# Altium project Temp_recorder_SAMD21.PrjPcb (part 2 of 2)

## Sheet RTD_Channel.SchDoc: RTD
size 420 x 297 mm; Author: G.Kasprowicz; CompanyName: WUT ISE; DrawnBy: G.Kasprowicz; Organization: WUT ISE; Address1: PW ISE; Address2: Nowowiejska 15/19 00-665 Warsaw; Address3: gkasprow@gmail.com; DocumentNumber: 2; Revision: 1.0; SheetNumber: 2; SheetTotal: 5; ModifiedBy: -; CheckedDate: -; Title2: converter; DivGrp: WUT ISE; Designer: G.Kasprowicz; ModifiedDate: -; ProjectName: Sensor Box
Used 8 times, as channels U_RTD_Channel0, U_RTD_Channel1, U_RTD_Channel2, U_RTD_Channel3, U_RTD_Channel4, U_RTD_Channel5, U_RTD_Channel6, U_RTD_Channel7. Parts and nets are listed once, with the designators drawn on the sheet.
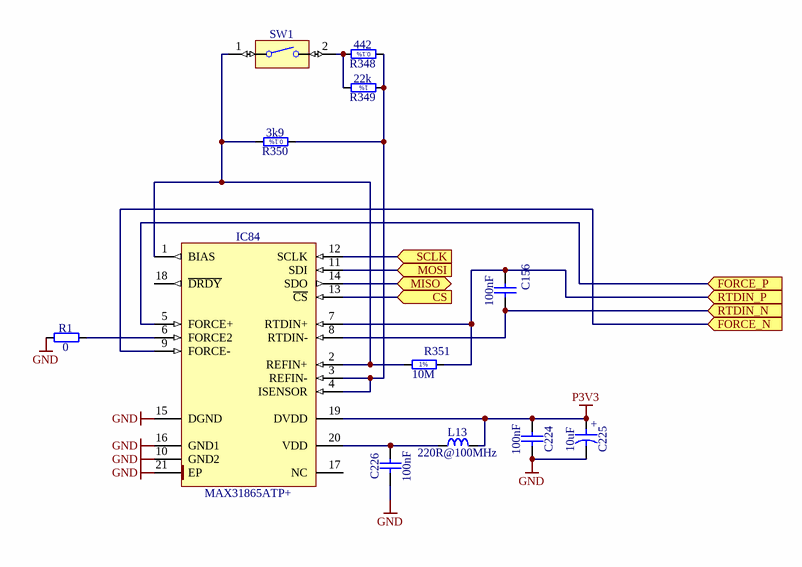
[diagram p2: RTD_Channel.SchDoc]

### Parts
C156  100nF  [CAPC1005X55N]
C224  100nF  [CAPC1005X55N]
C225  10uF  [CAPMP3216X180N]
C226  100nF  [CAPC1005X55N]
IC84  MAX31865ATP+  [QFN65P500X500X80-21N-S335]
L13  220R@100MHz  [INDC1005X55N]
R1  0  [RESC1005X40N]
R348  442  [RESC1608X55N]
R349  22k  [RESC1005X40N]
R350  3k9  [RESC1608X55N]
R351  10M  [RESC1608X55N]
SW1  Switch  [SW_OMRON_A6SN-1101]  (value not drawn)

### Ports
CS (in), FORCE_N (in), FORCE_P (in), MISO (bidir), MOSI (in), RTDIN_N (in), RTDIN_P (in), SCLK (in)

### Nets
GND: C224.2 C225.2 C226.1 IC84.10(GND2) IC84.15(DGND) IC84.16(GND1) IC84.21(EP) R1.1
P3V3: C224.1 C225.1 IC84.19(DVDD) L13.2
CS: IC84.13(~{CS}) ; port CS
FORCE_N: IC84.9(FORCE-) ; port FORCE_N
FORCE_P: IC84.5(FORCE+) ; port FORCE_P
MISO: IC84.14(SDO) ; port MISO
MOSI: IC84.11(SDI) ; port MOSI
RTDIN_N: C156.2 IC84.8(RTDIN-) ; port RTDIN_N
RTDIN_P: C156.1 IC84.7(RTDIN+) R351.2 ; port RTDIN_P
SCLK: IC84.12(SCLK) ; port SCLK
NetC226_2: C226.2 IC84.20(VDD) L13.1
NetIC84_1: IC84.1(BIAS) IC84.2(REFIN+) R350.2 R351.1 SW1.1
NetIC84_3: IC84.3(REFIN-) IC84.4(ISENSOR) R348.1 R349.1 R350.1
NetIC84_6: IC84.6(FORCE2) R1.2
NetR348_2: R348.2 R349.2 SW1.2

Not connected (* = marked no-connect by the designer): IC84 17(NC) 18(~{DRDY})

### Channels
U_RTD_Channel0: designators end in A; ports CS=MAX_CS0 FORCE_N=FORCE_N0 FORCE_P=FORCE_P0 MISO=MAX_MISO MOSI=MAX_MOSI RTDIN_N=RTDIN_N0 RTDIN_P=RTDIN_P0 SCLK=MAX_SCLK
U_RTD_Channel1: designators end in B; ports CS=MAX_CS1 FORCE_N=FORCE_N1 FORCE_P=FORCE_P1 MISO=MAX_MISO MOSI=MAX_MOSI RTDIN_N=RTDIN_N1 RTDIN_P=RTDIN_P1 SCLK=MAX_SCLK
U_RTD_Channel2: designators end in C; ports CS=MAX_CS2 FORCE_N=FORCE_N2 FORCE_P=FORCE_P2 MISO=MAX_MISO MOSI=MAX_MOSI RTDIN_N=RTDIN_N2 RTDIN_P=RTDIN_P2 SCLK=MAX_SCLK
U_RTD_Channel3: designators end in D; ports CS=MAX_CS3 FORCE_N=FORCE_N3 FORCE_P=FORCE_P3 MISO=MAX_MISO MOSI=MAX_MOSI RTDIN_N=RTDIN_N3 RTDIN_P=RTDIN_P3 SCLK=MAX_SCLK
U_RTD_Channel4: designators end in E; ports CS=MAX_CS4 FORCE_N=FORCE_N4 FORCE_P=FORCE_P4 MISO=MAX_MISO MOSI=MAX_MOSI RTDIN_N=RTDIN_N4 RTDIN_P=RTDIN_P4 SCLK=MAX_SCLK
U_RTD_Channel5: designators end in F; ports CS=MAX_CS5 FORCE_N=FORCE_N5 FORCE_P=FORCE_P5 MISO=MAX_MISO MOSI=MAX_MOSI RTDIN_N=RTDIN_N5 RTDIN_P=RTDIN_P5 SCLK=MAX_SCLK
U_RTD_Channel6: designators end in G; ports CS=MAX_CS6 FORCE_N=FORCE_N6 FORCE_P=FORCE_P6 MISO=MAX_MISO MOSI=MAX_MOSI RTDIN_N=RTDIN_N6 RTDIN_P=RTDIN_P6 SCLK=MAX_SCLK
U_RTD_Channel7: designators end in H; ports CS=MAX_CS7 FORCE_N=FORCE_N7 FORCE_P=FORCE_P7 MISO=MAX_MISO MOSI=MAX_MOSI RTDIN_N=RTDIN_N7 RTDIN_P=RTDIN_P7 SCLK=MAX_SCLK

### Notes on the sheet
- Project/Equipment
- Document
- Designer
- Drawn by
- Check.by
- Copyright WUT ISE 2020.
  This documentation describes Open Hardware and is licensed under the CERN OHL v.1.2. You may redistribute and modify this documentation under the terms of the CERN OHL v.1.2. (http://ohwr.org/CERNOHL). This documentation is distributed WITHOUT ANY EXPRESS OR IMPLIED WARRANTY, INCLUDING OF MERCHANTABILITY, SATISFACTORY QUALITY AND FITNESS FOR A PARTICULAR PURPOSE. Please see the CERN OHL v.1.2 for applicable conditions.
- Contact
- File
- Last Mod.
- Print Date
- Sheet
- Size
- A3
- of
- Rev
- (in symbol CTE3216-18_10UF_16V_20%_AVX_TCJ) +
- (in symbol R0402_22K_1%_0.0625W_100PPM) 1%
- (in symbol R0603_10M_1%_0.1W_100PPM) 1%
- (in symbol RES_0603_3k9_0.1%_10ppm) 0.1%
- (in symbol RES_0603_442R_0.1%_25ppm) 0.1%

### Library data of the parts
C156 C224 C226 = CC0402_100NF_16V_10%_X5R: Non-polarised capacitor; Part Description: SMD Multilayer Chip Ceramic Capacitor; Manufacturer: GENERIC; Manufacturer1 Part Number: GRM155R61C104KA88D; Voltage: 16V; TC: X5R; Tolerance: ±10%; Part Number: CC0402_100NF_16V_10%_X5R; Component Kind: Standard; Component Type: Standard; Pin Count: 2; Value: 100nF; Status: None; Manufacturer Part Number: CC0402_100NF_16V_10%_X5R; Case: 0402; Mounted: Yes; Socket: No; SMD: Yes; Sense: No; Manufacturer1 Example: MURATA; Manufacturer1 ComponentHeight: 0.55mm; HelpURL: \\cern.ch\dfs\Applications\Altium\Datasheets\CC0402_X5R_MURATA_GRM.pdf; Author: CERN DEM JLC; CreateDate: 10.12.2013; LatestRevisionDate: 10.12.2013
C225 = CTE3216-18_10UF_16V_20%_AVX_TCJ: Polarised capacitor; Part Description: ESR 0R200 Tantalum Solid Electrolytic Chip Capacitor with Conductive Polymer Electrode; Manufacturer: AVX; Manufacturer Part Number: TCJA106M016R0200; Voltage: 16V; Tolerance: ±20%; Part Number: CTE3216-18_10UF_16V_20%_AVX_TCJ; Component Kind: Standard; Component Type: Standard; Pin Count: 2; Value: 10uF; Status: Preferred; Case: A; Mounted: Yes; Socket: No; SMD: Yes; Sense: No; ComponentHeight: 1.8mm; HelpURL: \\cern.ch\dfs\Applications\Altium\Datasheets\CTE_AVX_TCJ.pdf; Author: CERN DEM JLC; CreateDate: 29.03.2012; LatestRevisionDate: 29.03.2012
IC84 = MAX31865ATP+: RTD-to-Digital Converter; Manufacturer: MAXIM; PressFit: No; Bonding: No; Part Number: MAX31865ATP+; Component Kind: Standard; Component Type: Standard; Device: MAX31865ATP+; PackageDescription: QFN, 0.65mm pitch, Square; 20 pin, 5.00mm L X 5.00mm W X 0.80mm H Body (W/Thermal Tab 3.35mm X 3.35mm), IPC Medium Density; Part Description: RTD-to-Digital Converter; Manufacturer Part Number: MAX31865ATP+; Pin Count: 21; Case: QFN20; Mounted: Yes; Socket: No; SMD: Yes; Sense: No; ComponentHeight: 0.8mm; Author: CERN DEM MR; HelpURL: \\cern.ch\dfs\Applications\Altium\Datasheets\MAX31865ATP+.pdf; CreateDate: 09.06.2016; LatestRevisionDate: 09.06.2016
L13 = IND0402_MURATA_BLM15HB221SN1: Inductor; Part Description: SMD EMIFIL Suppression Chip Ferrite Bead; Manufacturer: MURATA; Power: 250mA; Resistance: 1R; Tolerance: ±25%; Part Number: IND0402_MURATA_BLM15HB221SN1; Component Kind: Standard; Component Type: Standard; Pin Count: 2; Value: 220R@100MHz; Status: None; Manufacturer Part Number: BLM15HB221SN1; Case: 0402; Mounted: Yes; Socket: No; SMD: Yes; Sense: No; ComponentHeight: 0.55mm; HelpURL: \\cern.ch\dfs\Applications\Altium\Datasheets\IND0402_MURATA_BLM15H.pdf; Author: CERN DEM JLC; CreateDate: 23.06.2009; LatestRevisionDate: 23.06.2009
R1 = R0402_0R_JUMPER: Resistor; Part Description: 1A (0.05R Max DC Resistance) Zero Ohm Jumper; Manufacturer: GENERIC; Manufacturer1 Part Number: 232270591001L; PressFit: No; Part Number: R0402_0R_JUMPER; Component Kind: Standard; Component Type: Standard; Pin Count: 2; Value: 0; Status: Not Recommended; Manufacturer Part Number: R0402_0R_JUMPER; Case: 0402; Mounted: Yes; Sense: No; Socket: No; SMD: Yes; Manufacturer1 Example: YAGEO PHYCOMP; Manufacturer1 ComponentHeight: 0.4mm; HelpURL: \\cern.ch\dfs\Applications\Altium\Datasheets\R0402_Phycomp_RC0402.pdf; Author: CERN DEM JLC; CreateDate: 03/12/2007; LatestRevisionDate: 17/10/2012
R348 = RES_0603_442R_0.1%_25ppm: Resistor - 0.1%; Part Number: R0603_442R_0.1%_0.063W_25PPM; Part Description: Thin Film Chip Resistor; Manufacturer: GENERIC; Manufacturer1 Part Number: RP73PF1J442RBTDF; Power: 0.063W; TC: ±25ppm; PressFit: No; Component Kind: Standard; Component Type: Standard; Pin Count: 2; Value: 442; Status: Not Recommended; Tolerance: ±0.1%; Manufacturer Part Number: R0603_442R_0.1%_0.063W_25PPM; Case: 0603; Mounted: Yes; Sense: No; Socket: No; SMD: Yes; Manufacturer1 Example: TYCO HOLSWORTHY; Manufacturer1 ComponentHeight: 0.5mm; HelpURL: \\cern.ch\dfs\Applications\Altium\Datasheets\R0603_Tyco_RN73.pdf; Author: GK; CreateDate: 03.12.2007; LatestRevisionDate: 13.03.2008
R349 = R0402_22K_1%_0.0625W_100PPM: Resistor - 1%; Part Description: General Purpose Thick Film Chip Resistor; Manufacturer: GENERIC; Manufacturer1 Part Number: 232270672203L; TC: ±100ppm/°C; PressFit: No; Part Number: R0402_22K_1%_0.0625W_100PPM; Component Kind: Standard; Component Type: Standard; Pin Count: 2; Value: 22k; Status: Not Recommended; Power: 0.0625W; Tolerance: ±1%; Manufacturer Part Number: R0402_22K_1%_0.0625W_100PPM; Case: 0402; Mounted: Yes; Sense: No; Socket: No; SMD: Yes; Manufacturer1 Example: YAGEO PHYCOMP; Manufacturer1 ComponentHeight: 0.4mm; HelpURL: \\cern.ch\dfs\Applications\Altium\Datasheets\R0402_Phycomp_RC0402.pdf; Author: CERN DEM JLC; CreateDate: 03.12.2007; LatestRevisionDate: 17.10.2012
R350 = RES_0603_3k9_0.1%_10ppm: Resistor - 0.1%; Part Number: R0603_3k9_0.1%_0.063W_10PPM; Part Description: Thin Film Chip Resistor; Manufacturer: GENERIC; Manufacturer1 Part Number: ERA3ARB392V; Power: 0.063W; TC: ±10ppm; PressFit: No; Component Kind: Standard; Component Type: Standard; Pin Count: 2; Value: 3k9; Status: Not Recommended; Tolerance: ±0.1%; Manufacturer Part Number: R0603_3k9_0.1%_0.063W_10PPM; Case: 0603; Mounted: Yes; Sense: No; Socket: No; SMD: Yes; Manufacturer1 Example: Panasonic; Manufacturer1 ComponentHeight: 0.5mm; HelpURL: \\cern.ch\dfs\Applications\Altium\Datasheets\R0603_Tyco_RN73.pdf; Author: GK; CreateDate: 03.12.2007; LatestRevisionDate: 13.03.2008
R351 = R0603_10M_1%_0.1W_100PPM: Resistor - 1%; Part Description: General Purpose Thick Film Chip Resistor; Manufacturer: GENERIC; Manufacturer1 Part Number: CRCW060310M0FKEA; Power: 0.1W; TC: ±100ppm/°C; PressFit: No; Part Number: R0603_10M_1%_0.1W_100PPM; Component Kind: Standard; Component Type: Standard; Pin Count: 2; Value: 10M; Status: Preferred; Tolerance: ±1%; Manufacturer Part Number: R0603_10M_1%_0.1W_100PPM; Case: 0603; Mounted: Yes; Sense: No; Socket: No; SMD: Yes; Manufacturer1 Example: VISHAY; Manufacturer1 ComponentHeight: 0.55mm; HelpURL: \\cern.ch\dfs\Applications\Altium\Datasheets\R0603_VISHAY_CRCW e3.pdf; Author: CERN DEM JLC; CreateDate: 12.01.2017; LatestRevisionDate: 12.01.2017
SW1 = SW_OMRON_A6SN-1101: 1 Ways SPST DIP Switch; Part Description: 1 Way SPST Surface-Mounting Slide Switch With Flat Actuator, Contact Rating 25mA 24VDC; Manufacturer: OMRON; PressFit: No; Part Number: SW_OMRON_A6SN-1101; Component Kind: Standard; Component Type: Standard; Pin Count: 2; PackageDescription: Body 4.48x7.5mm, 1 Way SPST Surface-Mounting Slide Switch With Flat Actuator (A6SN Series); Family: Switch; Mounted: Yes; Socket: No; SMD: Yes; Sense: No; Status: None; Manufacturer Part Number: A6SN-1101; ComponentHeight: 4.6mm; HelpURL: \\cern.ch\dfs\Applications\Altium\Datasheets\SW_OMRON_A6SN-1101.pdf; Author: CERN DEM JLC; CreateDate: 25.02.2013; LatestRevisionDate: 25.02.2013

## Sheet Supply.SchDoc: Supply & POE
size 420 x 297 mm; Author: G.Kasprowicz; CompanyName: WUT ISE; DrawnBy: G.Kasprowicz; Organization: WUT ISE; Address1: PW ISE; Address2: Nowowiejska 15/19 00-665 Warsaw; Address3: gkasprow@gmail.com; DocumentNumber: 4; Revision: 2; SheetNumber: 4; SheetTotal: 5; ModifiedBy: -; CheckedDate: -; DivGrp: WUT ISE; Designer: G.Kasprowicz; ModifiedDate: -; ProjectName: Sensor Box
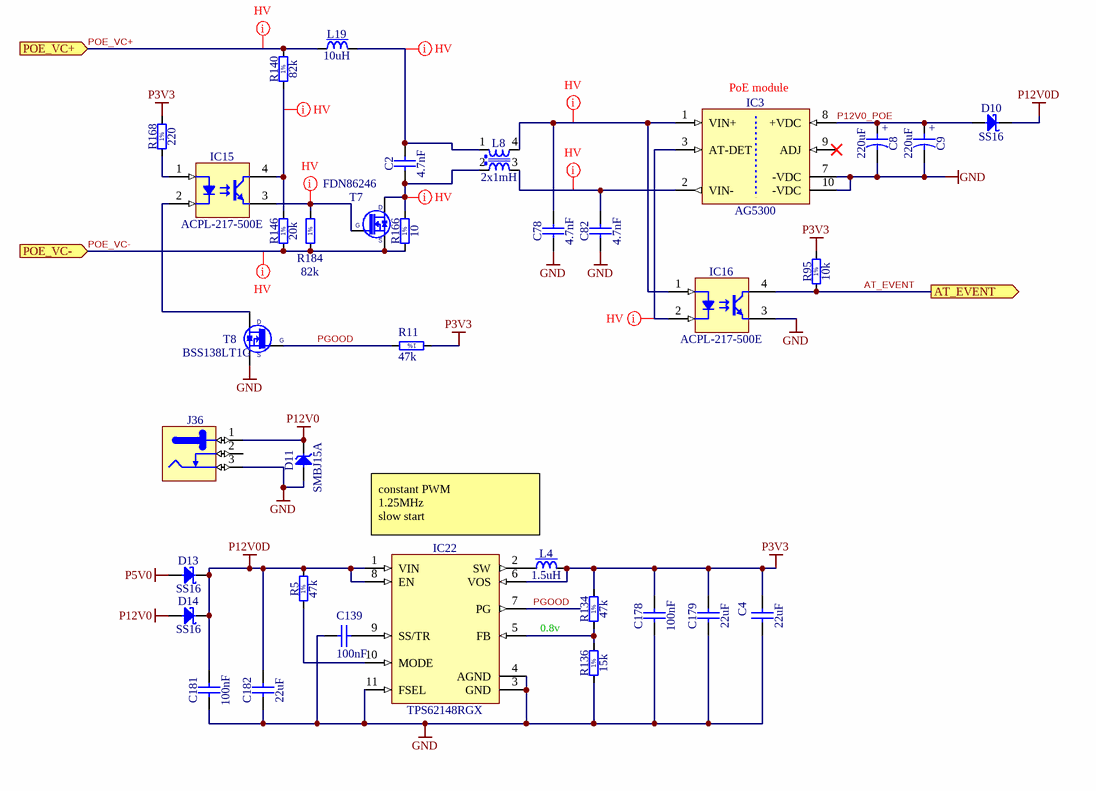
[diagram p3: Supply.SchDoc]

### Parts
C2  4.7nF  [CAPC3216X140N]
C4  22uF  [CAPC2012X135N]
C8  220uF  [CAPMP7343X430N]
C9  220uF  [CAPMP7343X430N]
C78  4.7nF  [CAPC3216X140N]
C82  4.7nF  [CAPC3216X140N]
C139  100nF  [CAPC1005X55N]
C178  100nF  [CAPC1005X55N]
C179  22uF  [CAPC2012X135N]
C181  100nF  [CAPC1005X55N]
C182  22uF  [CAPC2012X135N]
D10  SS16  [DIOM5127X229N]
D11  SMBJ15A  [DIOM5336X265N]
D13  SS16  [DIOM5127X229N]
D14  SS16  [DIOM5127X229N]
IC3  AG5300  [SILVERTEL_AG5300]
IC15  ACPL-217-500E  [SOIC127P700X242-4N]
IC16  ACPL-217-500E  [SOIC127P700X242-4N]
IC22  TPS62148RGX  [TEXAS_RGX0011A]
J36  Jack  [CLIFF_FC68148(DC-10A)]  (value not drawn)
L4  1.5uH  [IND_TDK_SPM6530]
L8  2x1mH  [IND_WURTH_WE-SL2]
L19  10uH  [IND_MURATA-PS_8400]
R5  47k  [RESC1608X55N]
R11  47k  [RESC1608X55N]
R95  10k  [RESC1005X40N]
R134  47k  [RESC1608X55N]
R136  15k  [RESC1608X55N]
R140  82k  [RESC1608X55N]
R146  20k  [RESC1005X40N]
R166  10  [RESC2012X60N]
R168  220  [RESC1608X55N]
R184  82k  [RESC1608X55N]
T7  FDN86246  [SOT95P237X112-3N]
T8  BSS138LT1G  [SOT95P240X110-3N]

### Ports
AT_EVENT (out), POE_VC+ (in), POE_VC- (in)

### Nets
GND: C4.1 C8.2 C9.2 C78.1 C82.1 C139.2 C178.1 C179.1 C181.1 C182.1 D11.2(A) IC3.7(-VDC) IC3.10(-VDC) IC16.3(E) IC22.3(GND) IC22.4(AGND) IC22.11(FSEL) J36.3 R136.1 T8.2(S)
P3V3: C4.2 C178.2 C179.2 IC22.6(VOS) L4.2 R11.1 R95.2 R134.2 R168.2
P5V0: D13.2(A)
P12V0: D11.1(C) D14.2(A) J36.1
P12V0D: C181.2 C182.2 D10.1(C) D13.1(C) D14.1(C) IC22.1(VIN) IC22.8(EN) R5.2
AT_EVENT: IC16.4(C) R95.1 ; port AT_EVENT
P12V0_POE: C8.1 C9.1 D10.2(A) IC3.8(+VDC)
PGOOD: IC22.7(PG) R11.2 T8.1(G)
POE_VC+: L19.1 R140.2 ; port POE_VC+
POE_VC-: R146.1 R166.1 R184.1 T7.2(S) ; port POE_VC-
NetC2_1: C2.1 L8.2 R166.2 T7.3(D)
NetC2_2: C2.2 L8.1 L19.2
NetC78_2: C78.2 IC3.1(VIN+) IC16.1(A) L8.4
NetC82_2: C82.2 IC3.2(VIN-) L8.3
NetC139_1: C139.1 IC22.9(SS/TR)
NetIC3_3: IC3.3(AT-DET) IC16.2(C)
NetIC15_1: IC15.1(A) R168.1
NetIC15_2: IC15.2(C) T8.3(D)
NetIC15_3: IC15.3(E) R184.2 T7.1(G)
NetIC15_4: IC15.4(C) R140.1 R146.2
NetIC22_2: IC22.2(SW) L4.1
NetIC22_5: IC22.5(FB) R134.1 R136.2
NetIC22_10: IC22.10(MODE) R5.1

Not connected (* = marked no-connect by the designer): IC3 9(ADJ)*; J36 2

### Layout directives
net class HV: NetC2_1, NetC2_2, NetC78_2, NetC82_2, NetIC3_3, NetIC15_3, NetIC15_4, POE_VC+, POE_VC-

### Notes on the sheet
- (near IC3) PoE module
- constant PWM
  1.25MHz
  slow start
- 0.8v
- Project/Equipment
- Document
- Designer
- Drawn by
- Check.by
- Copyright WUT ISE 2020.
  This documentation describes Open Hardware and is licensed under the CERN OHL v.1.2. You may redistribute and modify this documentation under the terms of the CERN OHL v.1.2. (http://ohwr.org/CERNOHL). This documentation is distributed WITHOUT ANY EXPRESS OR IMPLIED WARRANTY, INCLUDING OF MERCHANTABILITY, SATISFACTORY QUALITY AND FITNESS FOR A PARTICULAR PURPOSE. Please see the CERN OHL v.1.2 for applicable conditions.
- Contact
- File
- Last Mod.
- Print Date
- Sheet
- Size
- A3
- of
- Rev
- (in symbol CTE7343-43_220UF_16V_10%) +
- (in symbol R0402_10K_1%_0.0625W_100PPM) 1%
- (in symbol R0402_20K_1%_0.0625W_100PPM) 1%
- (in symbol R0603_15k_1%_0.1W_100PPM) 1%
- (in symbol R0603_47K_1%_0.1W_100PPM) 1%
- (in symbol R0603_82K_1%_0.1W_100PPM) 1%
- (in symbol R0603_220R_1%_0.1W_100PPM) 1%
- (in symbol R0805_10R_1%_0.125W_200PPM) 1%

### Library data of the parts
C2 C78 C82 = CAP_SMD_1206_4.7n_500V: Non-polarised capacitor; Part Number: CC1206_4.7NF_500V_10%_X7R; Part Description: SMD Multilayer Chip Ceramic Capacitor; Manufacturer: GENERIC; Manufacturer1 Part Number: C1206C472KCRACTU; Voltage: 500V; TC: X7R; Tolerance: ±10%; Table: Capacitors SMD; Component Kind: Standard; Component Type: Standard; Pin Count: 2; Value: 4.7nF; Status: Preferred; Manufacturer Part Number: CC1206_4.7NF_500V_10%_X7R; Case: 1206; Mounted: Yes; Socket: No; SMD: Yes; Manufacturer1 Example: KEMET; Manufacturer1 ComponentHeight: 1.7mm; HelpURL: \\cern.ch\dfs\Applications\Altium\Datasheets\CC1206_X7R_VISHAY_VJ.pdf; Author: GK; CreateDate: 2007-12-03; LatestRevisionDate: 2007-12-03
C4 C179 C182 = CC0805_22UF_16V_10%_X5R: Non-polarised capacitor; Part Description: SMD Multilayer Chip Ceramic Capacitor; Manufacturer: GENERIC; Manufacturer1 Part Number: C2012X5R1C226KT; Voltage: 16V; TC: X5R; Tolerance: ±10%; Part Number: CC0805_22UF_16V_10%_X5R; Component Kind: Standard; Component Type: Standard; Pin Count: 2; Value: 22uF; Status: Preferred; Manufacturer Part Number: CC0805_22UF_16V_10%_X5R; Case: 0805; Mounted: Yes; Socket: No; SMD: Yes; Sense: No; Manufacturer1 Example: TDK; Manufacturer1 ComponentHeight: 1.35mm; HelpURL: \\cern.ch\dfs\Applications\Altium\Datasheets\CC0805_X5R_TDK_C.pdf; Author: CERN DEM JLC; CreateDate: 25.10.2012; LatestRevisionDate: 25.10.2012
C8 C9 = CTE7343-43_220UF_16V_10%: Polarised capacitor; Part Description: Solid Tantalum Chip Capacitor; Manufacturer: GENERIC; Manufacturer1 Part Number: TAJE227K016R; Voltage: 16V; Tolerance: ±10%; Part Number: CTE7343-43_220UF_16V_10%; Component Kind: Standard; Component Type: Standard; Pin Count: 2; Value: 220uF; Status: Preferred; Manufacturer Part Number: CTE7343-43_220UF_16V_10%; Case: E; Mounted: Yes; Socket: No; SMD: Yes; Sense: No; Manufacturer1 Example: AVX; Manufacturer1 ComponentHeight: 4.3mm; HelpURL: \\cern.ch\dfs\Applications\Altium\Datasheets\CTE_AVX_TAJ.pdf; Author: CERN DEM JLC; CreateDate: 03.12.2007; LatestRevisionDate: 03.12.2007
C139 C178 C181 = CC0402_100NF_16V_10%_X5R: as C156 on sheet RTD_Channel; Part Number: CC0402_100NF_16V_10%_X5R; Component Kind: Standard; Component Type: Standard; Pin Count: 2; Value: 100nF; Status: None; Manufacturer Part Number: CC0402_100NF_16V_10%_X5R; Case: 0402; Mounted: Yes; Socket: No; SMD: Yes; Sense: No; Manufacturer1 Example: MURATA; Manufacturer1 ComponentHeight: 0.55mm; HelpURL: \\cern.ch\dfs\Applications\Altium\Datasheets\CC0402_X5R_MURATA_GRM.pdf; Author: CERN DEM JLC; CreateDate: 10.12.2013; LatestRevisionDate: 10.12.2013
D10 D13 D14 = SS16: Schottky Diode; Part Description: Surface Mount Schottky Barrier Rectifier; Manufacturer: VISHAY GENERAL SEMICONDUCTOR; Voltage: 60V; Power: 1A; PressFit: No; Bonding: No; Part Number: SS16; Component Kind: Standard; Component Type: Standard; Device: SS16; PackageDescription: DO-214-AC Molded Diode, Body 5.1x2.7mm, IPC Medium Density; Manufacturer Part Number: SS16; Pin Count: 2; Case: DO-214AC; Mounted: Yes; Socket: No; SMD: Yes; Sense: No; ComponentHeight: 2.29mm; HelpURL: \\cern.ch\dfs\Applications\Altium\Datasheets\SS16.pdf; Author: CERN DEM JLC; CreateDate: 15.07.2008; LatestRevisionDate: 23.08.2010
D11 = SMBJ15A: Zener Diode; Part Description: Uni-Directional Transient Voltage Suppressor Diode; Manufacturer: FAIRCHILD SEMICONDUCTOR; Voltage: 15V; Power: 600W; PressFit: No; Bonding: No; Part Number: SMBJ15A; Component Kind: Standard; Component Type: Standard; Device: SMBJ15A; PackageDescription: DO-214-AA/SMB Diode, Molded Body; 5.34mm L X 3.625mm W X 2.65mm H, IPC Medium Density; Manufacturer Part Number: SMBJ15A; Pin Count: 2; Case: DO-214AA; Mounted: Yes; Socket: No; SMD: Yes; Sense: No; ComponentHeight: 2.65mm; HelpURL: \\cern.ch\dfs\Applications\Altium\Datasheets\SMBJ.pdf; Author: CERN DEM JLC; CreateDate: 08.12.2008; LatestRevisionDate: 19.12.2011
IC3 = AG5300: Power-over-Ethernet Plus (POE+) Module; Part Description: 12V 30W Power-over-Ethernet Plus (POE+); Manufacturer: SILVERTEL; PressFit: No; Bonding: No; Part Number: AG5300; Component Kind: Standard; Component Type: Standard; Device: AG5300; PackageDescription: Power-over-Ethernet Plus (POE+) Module, Body L 57.3mm x W 18mm x H 14mm; Manufacturer Part Number: AG5300; Pin Count: 10; Mounted: Yes; Socket: No; SMD: No; Sense: No; ComponentHeight: 14mm; HelpURL: \\cern.ch\dfs\Applications\Altium\Datasheets\AG5300.pdf; Author: CERN DEM JLC; CreateDate: 20.03.2018; LatestRevisionDate: 20.03.2018
IC15 IC16 = ACPL-217-500E: Single Optocoupler; Part Description: DC Input, Half-Pitch Phototransistor Optocoupler; Manufacturer: AVAGO TECHNOLOGIES; PressFit: No; Bonding: No; Part Number: ACPL-217-500E; Component Kind: Standard; Component Type: Standard; Device: ACPL-217-500E; PackageDescription: SOIC, 1.27mm, pitch; 4 pin, 2.60mm W X 4.40mm L X 2.42mm H body, IPC Medium Density; Status: Not Recommended; Manufacturer Part Number: ACPL-217-500E; Pin Count: 4; Case: SOIC4; Mounted: Yes; Socket: No; SMD: Yes; Sense: No; ComponentHeight: 2.42mm; HelpURL: \\cern.ch\dfs\Applications\Altium\Datasheets\ACPL-217-500E.pdf; Author: CERN DEM JLC; CreateDate: 11.11.2014; LatestRevisionDate: 11.11.2014
IC22 = TPS62148RGX: 3V-17V 2A Step-Down Converter, High Accuracy, With DCS-Control; Manufacturer: TEXAS INSTRUMENTS; PressFit: No; Bonding: No; Part Number: TPS62148RGX; Component Kind: Standard; Component Type: Standard; Device: TPS62148RGX; PackageDescription: TEXAS Case Style (R-VQFN-HR-N11), 0.50mm Pitch, 11-pin, 2.00mm W X 3.00mm L X 1.00mm H Body; Part Description: 3V-17V 2A Step-Down Converter, High Accuracy, With DCS-Control; Manufacturer Part Number: TPS62148RGX; Pin Count: 11; Case: QFN14; Mounted: Yes; Socket: No; SMD: Yes; Sense: No; ComponentHeight: 1mm; HelpURL: \\cern.ch\dfs\Applications\Altium\Datasheets\TPS62148RGX.pdf; Author: CERN DEM MR; CreateDate: 08.02.2019; LatestRevisionDate: 08.02.2019
J36 = CLIFF_FC68148(DC-10A): 12V /  5A, 2.1mm Diameter Pin, DC Power Socket With  Switch. DC10A Type; Part Description: 12V/5A, 2.1mm Diameter Pin, DC Power Socket With  Switch (DC10A Type); Manufacturer: CLIFF ELECTRONIC COMPONENTS; PressFit: No; Part Number: CLIFF_FC68148(DC-10A); Component Kind: Standard; Component Type: Standard; Pin Count: 3; Family: Jack; Mounted: Yes; Socket: No; SMD: No; Sense: No; Status: None; Manufacturer Part Number: FC68148 (DC-10A); ComponentHeight: 11mm; HelpURL: \\cern.ch\dfs\Applications\Altium\Datasheets\CLIFF_FC68148(DC-10A).pdf; Author: CERN DEM JLC; CreateDate: 23/11/2010; LatestRevisionDate: 23/11/2010
L4 = IND_1.5UH_20%_TDK_SPM6530: Inductor With Core; Part Description: SMD Inductor for Power Circuits (Wound Metal), SPM Series; Manufacturer: TDK; Manufacturer Part Number: SPM6530T-1R5M100; Power: 11A; Resistance: 0.0097R; Tolerance: ±20%; Part Number: IND_1.5UH_20%_TDK_SPM6530; Component Kind: Standard; Component Type: Standard; Pin Count: 2; Value: 1.5uH; Status: None; Mounted: Yes; Socket: No; SMD: Yes; Sense: No; ComponentHeight: 3mm; HelpURL: \\cern.ch\dfs\Applications\Altium\Datasheets\IND_TDK_SPM6530.pdf; Author: CERN DEM MR; CreateDate: 08.11.2016; LatestRevisionDate: 08.11.2016
L8 = IND_1MH_50%_WURTH_WE-SL2-744222: Inductor Common Mode; Part Description: Common Mode SMD Line Filter (WE-SL2 Series); Manufacturer: WURTH ELEKTRONIK; Manufacturer Part Number: 744222; Power: 800mA; Resistance: 0.31R; Tolerance: ±50%; Part Number: IND_1MH_50%_WURTH_WE-SL2-744222; Component Kind: Standard; Component Type: Standard; Pin Count: 4; Value: 2x1mH; Status: None; Mounted: Yes; Socket: No; SMD: Yes; Sense: No; ComponentHeight: 5.3mm; HelpURL: \\cern.ch\dfs\Applications\Altium\Datasheets\IND_WURTH_WE-SL2_744222.pdf; Author: CERN DEM JLC; CreateDate: 04.06.2012; LatestRevisionDate: 15.10.2012
L19 = IND_10UH_10%_MURATA-PS_8400: Inductor With Core; Part Description: Miniature Surface Mount Power Inductor (8400 Serie); Manufacturer: MURATA POWER SOLUTIONS; Manufacturer Part Number: 84103C; Power: 950mA; Resistance: 0.24R; Tolerance: ±10%; Part Number: IND_10UH_10%_MURATA-PS_8400; Component Kind: Standard; Component Type: Standard; Pin Count: 2; Value: 10uH; Status: None; Mounted: Yes; Socket: No; SMD: Yes; Sense: No; ComponentHeight: 2.9mm; HelpURL: \\cern.ch\dfs\Applications\Altium\Datasheets\IND_MURATA-PS_8400.pdf; Author: CERN DEM JLC; CreateDate: 02.07.2012; LatestRevisionDate: 02.07.2012
R5 R11 R134 = R0603_47K_1%_0.1W_100PPM: Resistor - 1%; Part Description: General Purpose Thick Film Chip Resistor; Manufacturer: GENERIC; Manufacturer1 Part Number: NRC06F4702TRF; Power: 0.1W; TC: ±100ppm/°C; Part Number: R0603_47K_1%_0.1W_100PPM; Component Kind: Standard; Component Type: Standard; Pin Count: 2; Value: 47k; Status: Preferred; Tolerance: ±1%; Manufacturer Part Number: R0603_47K_1%_0.1W_100PPM; Case: 0603; Mounted: Yes; Sense: No; Socket: No; SMD: Yes; Manufacturer1 Example: NIC COMPONENT; Manufacturer1 ComponentHeight: 0.55mm; HelpURL: \\cern.ch\dfs\Applications\Altium\Datasheets\R0603_NIC_NRC.pdf; Author: CERN DEM JLC; CreateDate: 03.12.2007; LatestRevisionDate: 13.03.2008
R95 = R0402_10K_1%_0.0625W_100PPM: Resistor - 1%; Part Description: General Purpose Thick Film Chip Resistor; Manufacturer: GENERIC; Manufacturer1 Part Number: 232270671003L; TC: ±100ppm/°C; PressFit: No; Part Number: R0402_10K_1%_0.0625W_100PPM; Component Kind: Standard; Component Type: Standard; Pin Count: 2; Value: 10k; Status: Not Recommended; Power: 0.0625W; Tolerance: ±1%; Manufacturer Part Number: R0402_10K_1%_0.0625W_100PPM; Case: 0402; Mounted: Yes; Sense: No; Socket: No; SMD: Yes; Manufacturer1 Example: YAGEO PHYCOMP; Manufacturer1 ComponentHeight: 0.4mm; HelpURL: \\cern.ch\dfs\Applications\Altium\Datasheets\R0402_Phycomp_RC0402.pdf; Author: CERN DEM JLC; CreateDate: 03.12.2007; LatestRevisionDate: 17.10.2012
R136 = R0603_15k_1%_0.1W_100PPM: Resistor - 1%; Part Description: General Purpose Thick Film Chip Resistor; Manufacturer: GENERIC; Manufacturer1 Part Number: NRC06F1502TRF; Power: 0.1W; TC: ±100ppm/°C; PressFit: No; Part Number: R0603_15K_1%_0.1W_100PPM; Component Kind: Standard; Component Type: Standard; Pin Count: 2; Value: 15k; Status: Preferred; Tolerance: ±1%; Manufacturer Part Number: R0603_15K_1%_0.1W_100PPM; Case: 0603; Mounted: Yes; Sense: No; Socket: No; SMD: Yes; Manufacturer1 Example: NIC COMPONENT; Manufacturer1 ComponentHeight: 0.55mm; HelpURL: \\cern.ch\dfs\Applications\Altium\Datasheets\R0603_NIC_NRC.pdf; Author: CERN DEM JMW; CreateDate: 17/08/2015; LatestRevisionDate: 17/08/2015
R140 R184 = R0603_82K_1%_0.1W_100PPM: Resistor - 1%; Part Description: General Purpose Thick Film Chip Resistor; Manufacturer: GENERIC; Manufacturer1 Part Number: NRC06F8202TRF; Power: 0.1W; TC: ±100ppm/°C; Part Number: R0603_82K_1%_0.1W_100PPM; Component Kind: Standard; Component Type: Standard; Pin Count: 2; Value: 82k; Status: Preferred; Tolerance: ±1%; Manufacturer Part Number: R0603_82K_1%_0.1W_100PPM; Case: 0603; Mounted: Yes; Sense: No; Socket: No; SMD: Yes; Manufacturer1 Example: NIC COMPONENT; Manufacturer1 ComponentHeight: 0.55mm; HelpURL: \\cern.ch\dfs\Applications\Altium\Datasheets\R0603_NIC_NRC.pdf; Author: CERN DEM JLC; CreateDate: 03.12.2007; LatestRevisionDate: 13.03.2008
R146 = R0402_20K_1%_0.0625W_100PPM: Resistor - 1%; Part Description: General Purpose Thick Film Chip Resistor; Manufacturer: GENERIC; Manufacturer1 Part Number: 232270672003L; TC: ±100ppm/°C; PressFit: No; Part Number: R0402_20K_1%_0.0625W_100PPM; Component Kind: Standard; Component Type: Standard; Pin Count: 2; Value: 20k; Status: Not Recommended; Power: 0.0625W; Tolerance: ±1%; Manufacturer Part Number: R0402_20K_1%_0.0625W_100PPM; Case: 0402; Mounted: Yes; Sense: No; Socket: No; SMD: Yes; Manufacturer1 Example: YAGEO PHYCOMP; Manufacturer1 ComponentHeight: 0.4mm; HelpURL: \\cern.ch\dfs\Applications\Altium\Datasheets\R0402_Phycomp_RC0402.pdf; Author: CERN DEM JLC; CreateDate: 03.12.2007; LatestRevisionDate: 17.10.2012
R166 = R0805_10R_1%_0.125W_200PPM: Resistor - 1%; Part Description: General Purpose Thick Film Chip Resistor; Manufacturer: GENERIC; Manufacturer1 Part Number: NRC10F10R0TRF; Power: 0.125W; TC: ±200ppm/°C; PressFit: No; Part Number: R0805_10R_1%_0.125W_200PPM; Component Kind: Standard; Component Type: Standard; Pin Count: 2; Value: 10; Status: Preferred; Tolerance: ±1%; Manufacturer Part Number: R0805_10R_1%_0.125W_200PPM; Case: 0805; Mounted: Yes; Sense: No; Socket: No; SMD: Yes; Manufacturer1 Example: NIC COMPONENT; Manufacturer1 ComponentHeight: 0.6mm; HelpURL: \\cern.ch\dfs\Applications\Altium\Datasheets\R0805_NIC_NRC.pdf; Author: CERN DEM JLC; CreateDate: 03.12.2007; LatestRevisionDate: 24.06.2009
R168 = R0603_220R_1%_0.1W_100PPM: Resistor - 1%; Part Description: General Purpose Thick Film Chip Resistor; Manufacturer: GENERIC; Manufacturer1 Part Number: NRC06F2200TRF; Power: 0.1W; TC: ±100ppm/°C; Part Number: R0603_220R_1%_0.1W_100PPM; Component Kind: Standard; Component Type: Standard; Pin Count: 2; Value: 220; Status: Preferred; Tolerance: ±1%; Manufacturer Part Number: R0603_220R_1%_0.1W_100PPM; Case: 0603; Mounted: Yes; Sense: No; Socket: No; SMD: Yes; Manufacturer1 Example: NIC COMPONENT; Manufacturer1 ComponentHeight: 0.55mm; HelpURL: \\cern.ch\dfs\Applications\Altium\Datasheets\R0603_NIC_NRC.pdf; Author: CERN DEM JLC; CreateDate: 03.12.2007; LatestRevisionDate: 13.03.2008
T7 = FDN86246: N-CHANNEL MOSFET WITH DIODE; Part Description: 150V 1.6A N-Channel Power Trench® MOSFET; Manufacturer: ON SEMICONDUCTOR; PressFit: No; Bonding: No; Part Number: FDN86246; Component Kind: Standard; Component Type: Standard; Device: FDN86246; PackageDescription: SOT, 0.95mm, pitch; 3 pin,1.30mm W X 2.92mm L X 1.12mm H body, IPC Medium Density; Manufacturer Part Number: FDN86246; Pin Count: 3; Case: SOT23-3; Mounted: Yes; Socket: No; SMD: Yes; Sense: No; ComponentHeight: 1.12mm; HelpURL: \\cern.ch\dfs\Applications\Altium\Datasheets\FDN86246.pdf; ComponentLink1URL: \\cern.ch\dfs\Applications\Altium\Datasheets\FDN86246_Package.pdf; ComponentLink1Description: Package Drawing; Author: CERN DEM BC; CreateDate: 10.10.2019; LatestRevisionDate: 10.10.2019
T8 = BSS138LT1G: N-CHANNEL MOSFET WITH DIODE; Part Description: 50V 200mA N-Channel Enhancement Mode Field-Effect Transistor; Manufacturer: ON SEMICONDUCTOR; PressFit: No; Bonding: No; Part Number: BSS138LT1G; Component Kind: Standard; Component Type: Standard; Device: BSS138LT1G; PackageDescription: SOT23 3-Leads, Pitch 0.95mm - Body 1.4x3mm, IPC Medium Density; Manufacturer Part Number: BSS138LT1G; Pin Count: 3; Case: SOT23-3; Mounted: Yes; Socket: No; SMD: Yes; Sense: No; ComponentHeight: 1.11mm; HelpURL: \\cern.ch\dfs\Applications\Altium\Datasheets\BSS138LT1G.pdf; Author: CERN DEM JLC; CreateDate: 23.03.2009; LatestRevisionDate: 23.03.2009

## Sheet Adapters.SchDoc: various
size 420 x 297 mm; Author: G.Kasprowicz; CompanyName: WUT ISE; DrawnBy: G.Kasprowicz; Organization: WUT ISE; Address1: PW ISE; Address2: Nowowiejska 15/19 00-665 Warsaw; Address3: gkasprow@gmail.com; DocumentNumber: 5; Revision: 2; SheetNumber: 5; SheetTotal: 5; ModifiedBy: -; CheckedDate: -; Title2: adapters; DivGrp: WUT ISE; Designer: G.Kasprowicz; ModifiedDate: -; ProjectName: Sensor Box
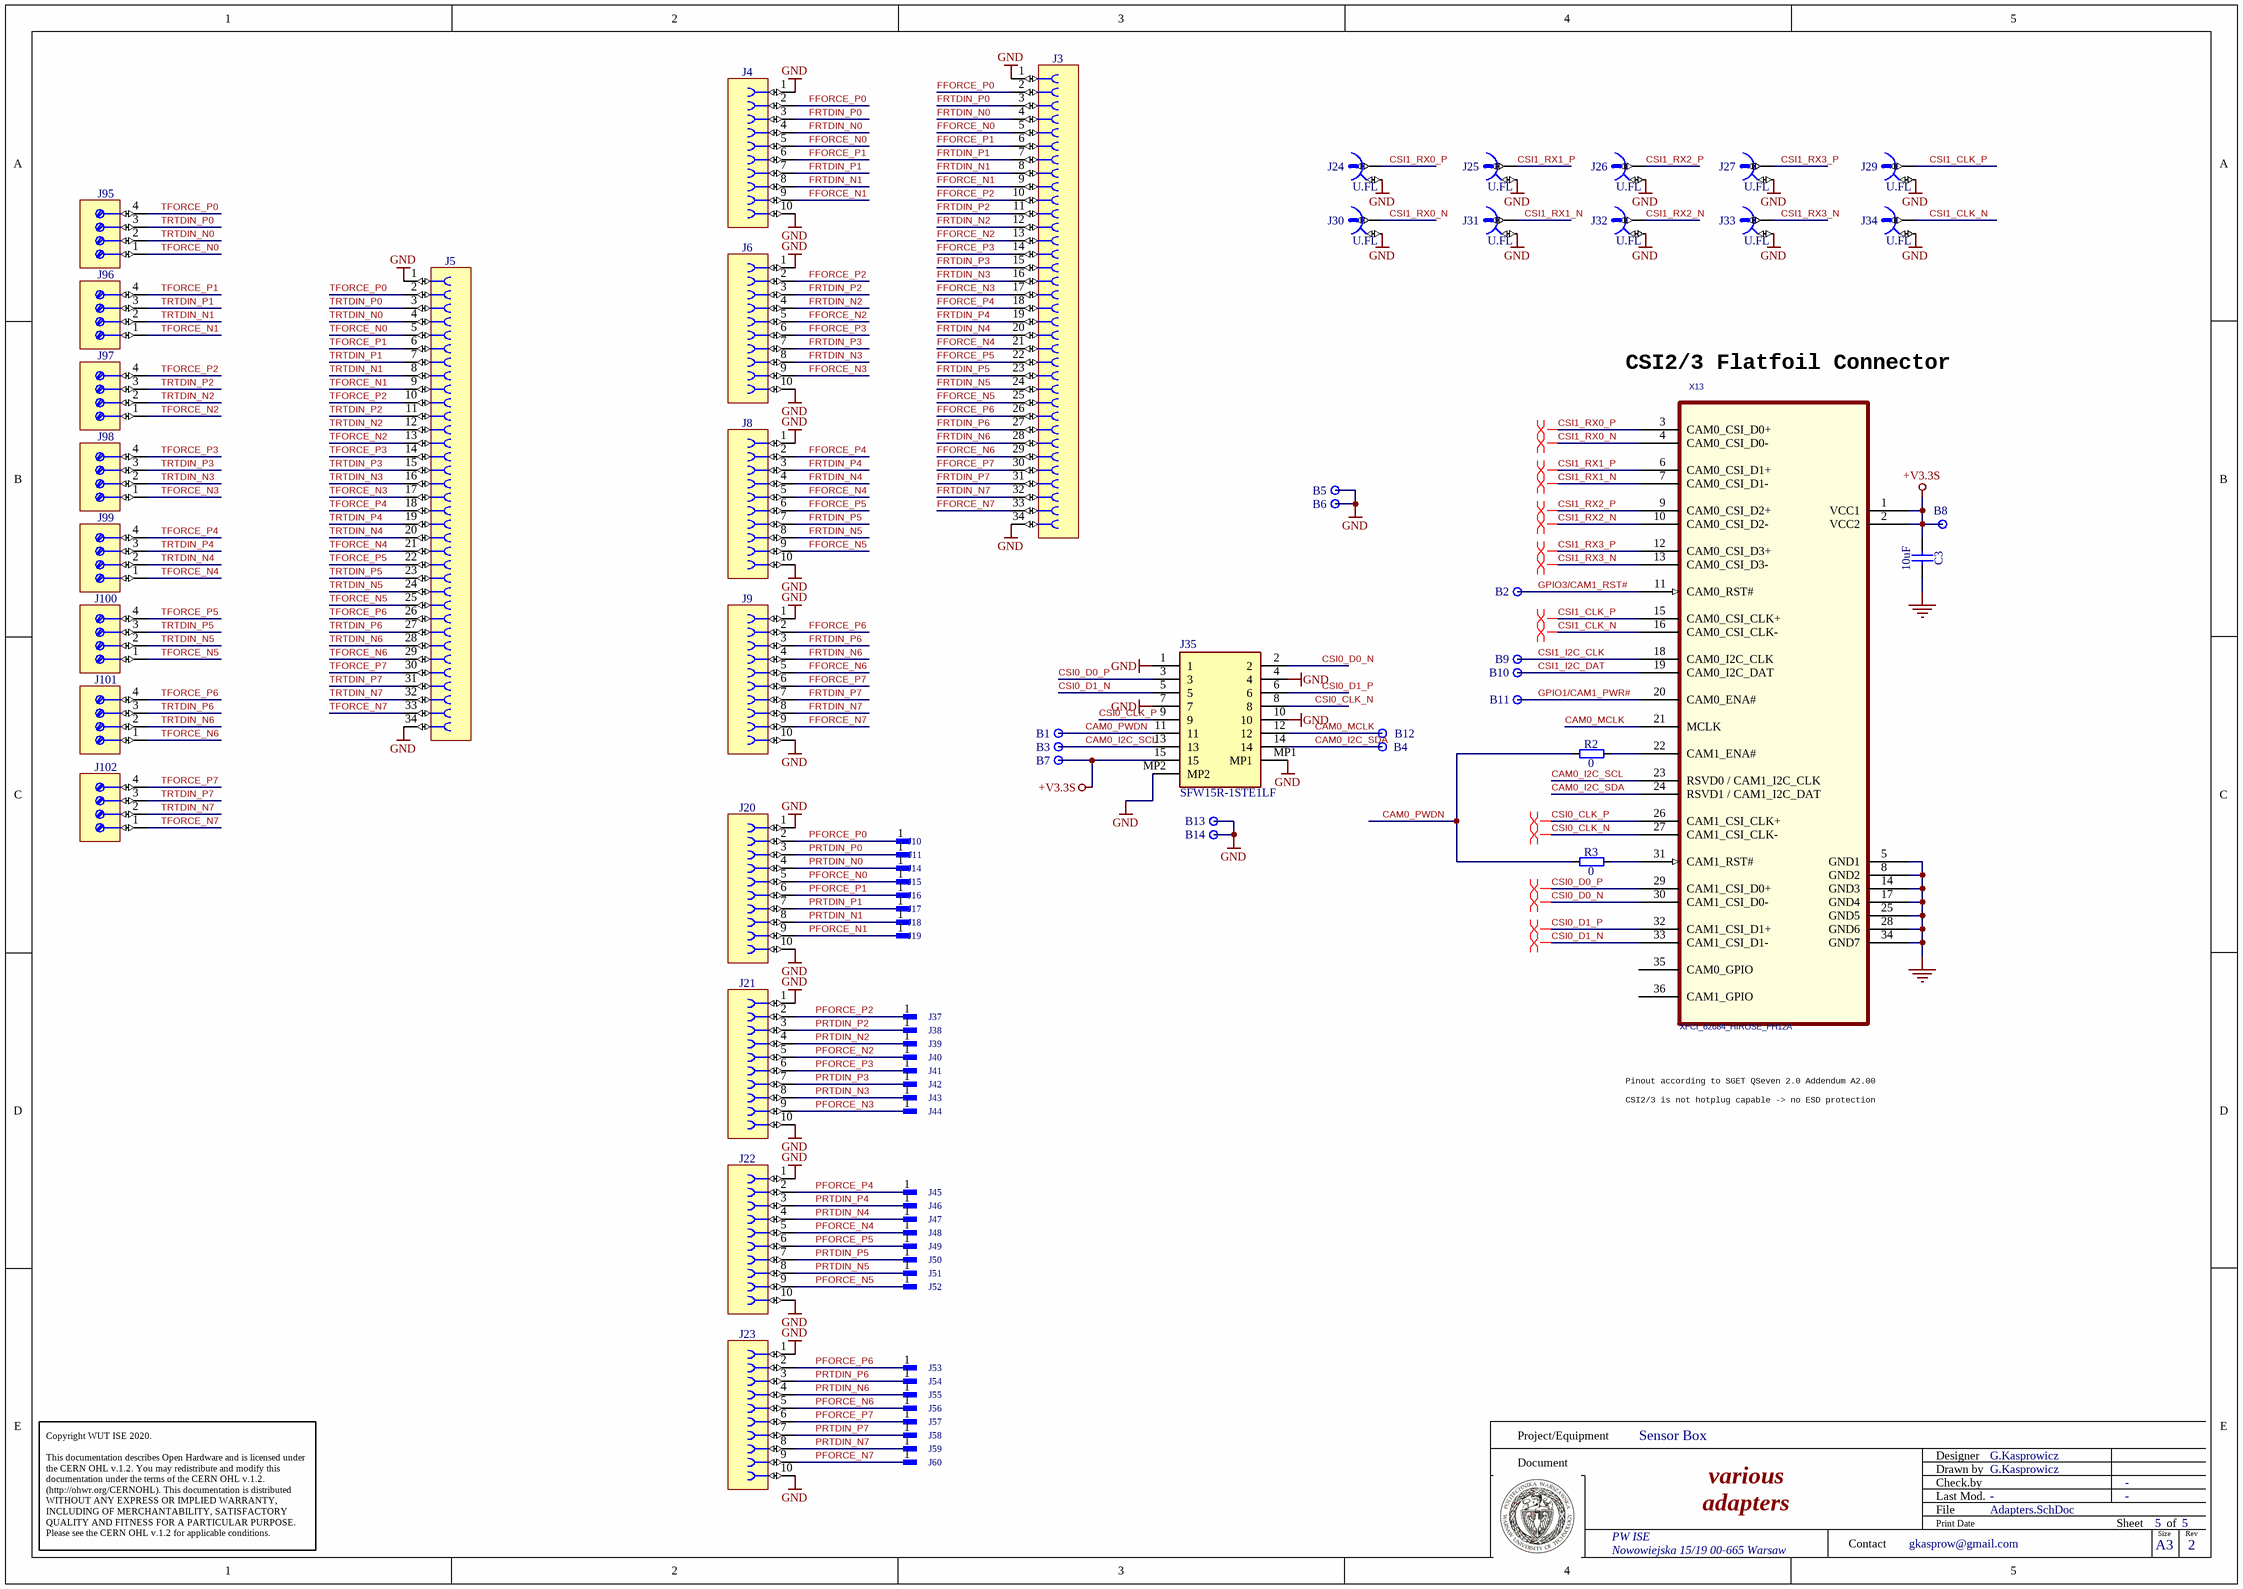
[diagram p4: Adapters.SchDoc]

### Parts
B1  Plated Hole  [c130h80]  (value not drawn)  (no BOM)
B2  Plated Hole  [c130h80]  (value not drawn)  (no BOM)
B3  Plated Hole  [c130h80]  (value not drawn)  (no BOM)
B4  Plated Hole  [c130h80]  (value not drawn)  (no BOM)
B5  Plated Hole  [c130h80]  (value not drawn)  (no BOM)
B6  Plated Hole  [c130h80]  (value not drawn)  (no BOM)
B7  Plated Hole  [c130h80]  (value not drawn)  (no BOM)
B8  Plated Hole  [c130h80]  (value not drawn)  (no BOM)
B9  Plated Hole  [c130h80]  (value not drawn)  (no BOM)
B10  Plated Hole  [c130h80]  (value not drawn)  (no BOM)
B11  Plated Hole  [c130h80]  (value not drawn)  (no BOM)
B12  Plated Hole  [c130h80]  (value not drawn)  (no BOM)
B13  Plated Hole  [c130h80]  (value not drawn)  (no BOM)
B14  Plated Hole  [c130h80]  (value not drawn)  (no BOM)
C3  10uF  [CAPC2012X135N]
J3  Socket 34  [3M_9134-4500PL]  (value not drawn)
J4  FFC/FPC  [MOLEX_52745-1097]  (value not drawn)
J5  Socket 34  [3M_9134-4500PL]  (value not drawn)
J6  FFC/FPC  [MOLEX_52745-1097]  (value not drawn)
J8  FFC/FPC  [MOLEX_52745-1097]  (value not drawn)
J9  FFC/FPC  [MOLEX_52745-1097]  (value not drawn)
J10  SMD Pad  [R350X200]  (value not drawn)
J11  SMD Pad  [R350X200]  (value not drawn)
J14  SMD Pad  [R350X200]  (value not drawn)
J15  SMD Pad  [R350X200]  (value not drawn)
J16  SMD Pad  [R350X200]  (value not drawn)
J17  SMD Pad  [R350X200]  (value not drawn)
J18  SMD Pad  [R350X200]  (value not drawn)
J19  SMD Pad  [R350X200]  (value not drawn)
J20  FFC/FPC  [MOLEX_52745-1097]  (value not drawn)
J21  FFC/FPC  [MOLEX_52745-1097]  (value not drawn)
J22  FFC/FPC  [MOLEX_52745-1097]  (value not drawn)
J23  FFC/FPC  [MOLEX_52745-1097]  (value not drawn)
J24  U.FL  [HIROSE_U.FL-R-SMT-1(10)]
J25  U.FL  [HIROSE_U.FL-R-SMT-1(10)]
J26  U.FL  [HIROSE_U.FL-R-SMT-1(10)]
J27  U.FL  [HIROSE_U.FL-R-SMT-1(10)]
J29  U.FL  [HIROSE_U.FL-R-SMT-1(10)]
J30  U.FL  [HIROSE_U.FL-R-SMT-1(10)]
J31  U.FL  [HIROSE_U.FL-R-SMT-1(10)]
J32  U.FL  [HIROSE_U.FL-R-SMT-1(10)]
J33  U.FL  [HIROSE_U.FL-R-SMT-1(10)]
J34  U.FL  [HIROSE_U.FL-R-SMT-1(10)]
J35  SFW15R-1STE1LF  [SFW15R1STE1LF]
J37  SMD Pad  [R350X200]  (value not drawn)
J38  SMD Pad  [R350X200]  (value not drawn)
J39  SMD Pad  [R350X200]  (value not drawn)
J40  SMD Pad  [R350X200]  (value not drawn)
J41  SMD Pad  [R350X200]  (value not drawn)
J42  SMD Pad  [R350X200]  (value not drawn)
J43  SMD Pad  [R350X200]  (value not drawn)
J44  SMD Pad  [R350X200]  (value not drawn)
J45  SMD Pad  [R350X200]  (value not drawn)
J46  SMD Pad  [R350X200]  (value not drawn)
J47  SMD Pad  [R350X200]  (value not drawn)
J48  SMD Pad  [R350X200]  (value not drawn)
J49  SMD Pad  [R350X200]  (value not drawn)
J50  SMD Pad  [R350X200]  (value not drawn)
J51  SMD Pad  [R350X200]  (value not drawn)
J52  SMD Pad  [R350X200]  (value not drawn)
J53  SMD Pad  [R350X200]  (value not drawn)
J54  SMD Pad  [R350X200]  (value not drawn)
J55  SMD Pad  [R350X200]  (value not drawn)
J56  SMD Pad  [R350X200]  (value not drawn)
J57  SMD Pad  [R350X200]  (value not drawn)
J58  SMD Pad  [R350X200]  (value not drawn)
J59  SMD Pad  [R350X200]  (value not drawn)
J60  SMD Pad  [R350X200]  (value not drawn)
J95  (no value)  [PHOENIX_1725672]
J96  (no value)  [PHOENIX_1725672]
J97  (no value)  [PHOENIX_1725672]
J98  (no value)  [PHOENIX_1725672]
J99  (no value)  [PHOENIX_1725672]
J100  (no value)  [PHOENIX_1725672]
J101  (no value)  [PHOENIX_1725672]
J102  (no value)  [PHOENIX_1725672]
R2  0  [RESC1005X40N]
R3  0  [RESC1005X40N]
X13  XFCI_62684_HIROSE_FH12A  [TYCO_3-1734592-6]

### Nets
+V3.3S: B7.1 B8.1 C3.1 J35.15 X13.1(VCC1) X13.2(VCC2)
GND: B5.1 B6.1 B13.1 B14.1 C3.2 J3.1 J3.34 J4.1 J4.10 J5.1 J5.34 J6.1 J6.10 J8.1 J8.10 J9.1 J9.10 J20.1 J20.10 J21.1 J21.10 J22.1 J22.10 J23.1 J23.10 J24.2 J25.2 J26.2 J27.2 J29.2 J30.2 J31.2 J32.2 J33.2 J34.2 J35.1 J35.4 J35.7 J35.10 J35.MP1 J35.MP2 X13.5(GND1) X13.8(GND2) X13.14(GND3) X13.17(GND4) X13.25(GND5) X13.28(GND6) X13.34(GND7)
CAM0_I2C_SCL: B3.1 J35.13 X13.23(RSVD0_/_CAM1_I2C_CLK)
CAM0_I2C_SDA: B4.1 J35.14 X13.24(RSVD1_/_CAM1_I2C_DAT)
CAM0_MCLK: B12.1 J35.12 X13.21(MCLK)
CAM0_PWDN: B1.1 J35.11 R2.1 R3.1
CSI0_CLK_N: J35.8 X13.27(CAM1_CSI_CLK-)
CSI0_CLK_P: J35.9 X13.26(CAM1_CSI_CLK+)
CSI0_D0_N: J35.2 X13.30(CAM1_CSI_D0-)
CSI0_D0_P: J35.3 X13.29(CAM1_CSI_D0+)
CSI0_D1_N: J35.5 X13.33(CAM1_CSI_D1-)
CSI0_D1_P: J35.6 X13.32(CAM1_CSI_D1+)
CSI1_CLK_N: J34.1 X13.16(CAM0_CSI_CLK-)
CSI1_CLK_P: J29.1 X13.15(CAM0_CSI_CLK+)
CSI1_I2C_CLK: B9.1 X13.18(CAM0_I2C_CLK)
CSI1_I2C_DAT: B10.1 X13.19(CAM0_I2C_DAT)
CSI1_RX0_N: J30.1 X13.4(CAM0_CSI_D0-)
CSI1_RX0_P: J24.1 X13.3(CAM0_CSI_D0+)
CSI1_RX1_N: J31.1 X13.7(CAM0_CSI_D1-)
CSI1_RX1_P: J25.1 X13.6(CAM0_CSI_D1+)
CSI1_RX2_N: J32.1 X13.10(CAM0_CSI_D2-)
CSI1_RX2_P: J26.1 X13.9(CAM0_CSI_D2+)
CSI1_RX3_N: J33.1 X13.13(CAM0_CSI_D3-)
CSI1_RX3_P: J27.1 X13.12(CAM0_CSI_D3+)
FFORCE_N0: J3.5 J4.5
FFORCE_N1: J3.9 J4.9
FFORCE_N2: J3.13 J6.5
FFORCE_N3: J3.17 J6.9
FFORCE_N4: J3.21 J8.5
FFORCE_N5: J3.25 J8.9
FFORCE_N6: J3.29 J9.5
FFORCE_N7: J3.33 J9.9
FFORCE_P0: J3.2 J4.2
FFORCE_P1: J3.6 J4.6
FFORCE_P2: J3.10 J6.2
FFORCE_P3: J3.14 J6.6
FFORCE_P4: J3.18 J8.2
FFORCE_P5: J3.22 J8.6
FFORCE_P6: J3.26 J9.2
FFORCE_P7: J3.30 J9.6
FRTDIN_N0: J3.4 J4.4
FRTDIN_N1: J3.8 J4.8
FRTDIN_N2: J3.12 J6.4
FRTDIN_N3: J3.16 J6.8
FRTDIN_N4: J3.20 J8.4
FRTDIN_N5: J3.24 J8.8
FRTDIN_N6: J3.28 J9.4
FRTDIN_N7: J3.32 J9.8
FRTDIN_P0: J3.3 J4.3
FRTDIN_P1: J3.7 J4.7
FRTDIN_P2: J3.11 J6.3
FRTDIN_P3: J3.15 J6.7
FRTDIN_P4: J3.19 J8.3
FRTDIN_P5: J3.23 J8.7
FRTDIN_P6: J3.27 J9.3
FRTDIN_P7: J3.31 J9.7
GPIO1/CAM1_PWR#: B11.1 X13.20(CAM0_ENA#)
GPIO3/CAM1_RST#: B2.1 X13.11(CAM0_RST#)
PFORCE_N0: J15.1 J20.5
PFORCE_N1: J19.1 J20.9
PFORCE_N2: J21.5 J40.1
PFORCE_N3: J21.9 J44.1
PFORCE_N4: J22.5 J48.1
PFORCE_N5: J22.9 J52.1
PFORCE_N6: J23.5 J56.1
PFORCE_N7: J23.9 J60.1
PFORCE_P0: J10.1 J20.2
PFORCE_P1: J16.1 J20.6
PFORCE_P2: J21.2 J37.1
PFORCE_P3: J21.6 J41.1
PFORCE_P4: J22.2 J45.1
PFORCE_P5: J22.6 J49.1
PFORCE_P6: J23.2 J53.1
PFORCE_P7: J23.6 J57.1
PRTDIN_N0: J14.1 J20.4
PRTDIN_N1: J18.1 J20.8
PRTDIN_N2: J21.4 J39.1
PRTDIN_N3: J21.8 J43.1
PRTDIN_N4: J22.4 J47.1
PRTDIN_N5: J22.8 J51.1
PRTDIN_N6: J23.4 J55.1
PRTDIN_N7: J23.8 J59.1
PRTDIN_P0: J11.1 J20.3
PRTDIN_P1: J17.1 J20.7
PRTDIN_P2: J21.3 J38.1
PRTDIN_P3: J21.7 J42.1
PRTDIN_P4: J22.3 J46.1
PRTDIN_P5: J22.7 J50.1
PRTDIN_P6: J23.3 J54.1
PRTDIN_P7: J23.7 J58.1
TFORCE_N0: J5.5 J95.1
TFORCE_N1: J5.9 J96.1
TFORCE_N2: J5.13 J97.1
TFORCE_N3: J5.17 J98.1
TFORCE_N4: J5.21 J99.1
TFORCE_N5: J5.25 J100.1
TFORCE_N6: J5.29 J101.1
TFORCE_N7: J5.33 J102.1
TFORCE_P0: J5.2 J95.4
TFORCE_P1: J5.6 J96.4
TFORCE_P2: J5.10 J97.4
TFORCE_P3: J5.14 J98.4
TFORCE_P4: J5.18 J99.4
TFORCE_P5: J5.22 J100.4
TFORCE_P6: J5.26 J101.4
TFORCE_P7: J5.30 J102.4
TRTDIN_N0: J5.4 J95.2
TRTDIN_N1: J5.8 J96.2
TRTDIN_N2: J5.12 J97.2
TRTDIN_N3: J5.16 J98.2
TRTDIN_N4: J5.20 J99.2
TRTDIN_N5: J5.24 J100.2
TRTDIN_N6: J5.28 J101.2
TRTDIN_N7: J5.32 J102.2
TRTDIN_P0: J5.3 J95.3
TRTDIN_P1: J5.7 J96.3
TRTDIN_P2: J5.11 J97.3
TRTDIN_P3: J5.15 J98.3
TRTDIN_P4: J5.19 J99.3
TRTDIN_P5: J5.23 J100.3
TRTDIN_P6: J5.27 J101.3
TRTDIN_P7: J5.31 J102.3
NetR2_2: R2.2 X13.22(CAM1_ENA#)
NetR3_2: R3.2 X13.31(CAM1_RST#)

Not connected (* = marked no-connect by the designer): X13 35(CAM0_GPIO) 36(CAM1_GPIO)

### Layout directives
differential pair: CSI0_CLK_N, CSI0_CLK_P, CSI0_D0_N, CSI0_D0_P, CSI0_D1_N, CSI0_D1_P, CSI1_CLK_N, CSI1_CLK_P, CSI1_RX0_N, CSI1_RX0_P, CSI1_RX1_N, CSI1_RX1_P, CSI1_RX2_N, CSI1_RX2_P, CSI1_RX3_N, CSI1_RX3_P

### Notes on the sheet
- CSI2/3 Flatfoil Connector
- Pinout according to SGET QSeven 2.0 Addendum A2.00
  CSI2/3 is not hotplug capable -> no ESD protection
- Project/Equipment
- Document
- Designer
- Drawn by
- Check.by
- Copyright WUT ISE 2020.
  This documentation describes Open Hardware and is licensed under the CERN OHL v.1.2. You may redistribute and modify this documentation under the terms of the CERN OHL v.1.2. (http://ohwr.org/CERNOHL). This documentation is distributed WITHOUT ANY EXPRESS OR IMPLIED WARRANTY, INCLUDING OF MERCHANTABILITY, SATISFACTORY QUALITY AND FITNESS FOR A PARTICULAR PURPOSE. Please see the CERN OHL v.1.2 for applicable conditions.
- Contact
- File
- Last Mod.
- Print Date
- Sheet
- Size
- A3
- of
- Rev

### Library data of the parts
B1-B14 = PLATED_HOLE0.8_PAD1.3: Single Terminal Socket; Part Description: Plated Through Hole: Hole Dia.=0.8mm Pad Dia.=1.3mm, IPC-7251 Level C; Mounted: No; Part Number: PLATED_HOLE0.8_PAD1.3; Component Type: Standard (No BOM); Pin Count: 1; Family: Plated Hole; Socket: No; SMD: No; Sense: No; Status: None; ComponentHeight: 0mm; HelpURL: Undefined; Author: CERN DEM JLC; CreateDate: 30.10.2008; LatestRevisionDate: 30.10.2008; PackageDescription: Plated Through Hole: Hole Dia.=0.8mm Pad Dia.=1.3mm, IPC-7251 Level C
C3 = CC0805_10UF_16V_10%_X5R: Non-polarised capacitor; Part Description: SMD Multilayer Chip Ceramic Capacitor; Manufacturer: GENERIC; Manufacturer1 Part Number: C0805C106K4PAC; Voltage: 16V; TC: X5R; Tolerance: ±10%; Part Number: CC0805_10UF_16V_10%_X5R; Component Kind: Standard; Component Type: Standard; Pin Count: 2; Value: 10uF; Status: Preferred; Manufacturer Part Number: CC0805_10UF_16V_10%_X5R; Case: 0805; Mounted: Yes; Socket: No; SMD: Yes; Manufacturer1 Example: KEMET; Manufacturer1 ComponentHeight: 1.4mm; HelpURL: \\cern.ch\dfs\Applications\Altium\Datasheets\CC1206_X5R_KEMET.pdf; Author: CERN DEM JLC; CreateDate: 03.12.2007; LatestRevisionDate: 03.12.2007; Sense: No
J3 J5 = 3M_9134-4500PL: Connector 34 Female; Part Description: 34 Contacts - Straight .100" x .100" Polarized Boardmount Socket, 9100 Series; Manufacturer: 3M; PressFit: No; Part Number: 3M_9134-4500PL; Component Kind: Standard; Component Type: Standard; Pin Count: 34; Family: Socket 34; Mounted: Yes; Socket: No; SMD: No; Sense: No; Status: None; Manufacturer Part Number: 9134-4500PL; ComponentHeight: 9mm; HelpURL: \\cern.ch\dfs\Applications\Altium\Datasheets\3M_9134-4500PL.pdf; Author: CERN DEM JLC; CreateDate: 11/02/2009; LatestRevisionDate: 11/08/2009
J4 J6 J8 J9 J20-J23 = MOLEX_52745-1097: Connector 10 Female; Part Description: 10 Contacts, 0.5mm Pitch, Right Angled Surface Mount FFC/FPC Connector, ZIF, Top Contact Style; Manufacturer: MOLEX; PressFit: No; Part Number: MOLEX_52745-1097; Component Kind: Standard; Component Type: Standard; Pin Count: 10; Family: FFC/FPC; Mounted: Yes; Socket: No; SMD: Yes; Sense: No; Status: None; Manufacturer Part Number: 52745-1097; ComponentHeight: 2mm; HelpURL: \\cern.ch\dfs\Applications\Altium\Datasheets\MOLEX_52745-1097.pdf; Author: CERN DEM JLC; CreateDate: 04/11/2014; LatestRevisionDate: 05/12/2014
J10 J11 J14-J19 J37-J60 = SMD_PAD_3.5X2MM: Single SMD Pad; Part Description: 3.5mm x 2mm SMD Pad; Mounted: No; Part Number: SMD_PAD_3.5X2MM; Component Kind: Standard (No BOM); Component Type: Standard (No BOM); Pin Count: 1; Family: SMD Pad; Socket: No; SMD: No; Sense: No; Status: None; ComponentHeight: 0mm; HelpURL: Undefined; Author: CERN DEM JLC; CreateDate: 15/03/2010; LatestRevisionDate: 15/03/2010; PackageDescription: 3.5mm x  2mm SMD Pad
J24-J27 J29-J34 = HIROSE_U.FL-R-SMT-1(10): Part Description: Up to 6GHz Ultra Small Surface Mount Male Coaxial Connectors U.FL Series; Manufacturer: HIROSE (HRS); PressFit: No; Part Number: HIROSE_U.FL-R-SMT-1(10); Component Kind: Standard; Component Type: Standard; Pin Count: 2; Family: U.FL; Mounted: Yes; Socket: No; SMD: Yes; Sense: No; Status: None; Manufacturer Part Number: U.FL-R-SMT-1(10); ComponentHeight: 1.25mm; HelpURL: \\cern.ch\dfs\Applications\Altium\Datasheets\HIROSE_U.FL-R-SMT-1(10).pdf; Author: CERN DEM JLC; CreateDate: 24/03/2010; LatestRevisionDate: 24/03/2010
J35 = SFW15R-1STE1LF: Connector; Manufacturer_Name: FCI; Datasheet Link: https://componentsearchengine.com/Datasheets/1/SFW15R-1STE1LF.pdf; Height: 2.7mm; Manufacturer_Part_Number: SFW15R-1STE1LF; Mouser Part Number: 649-SFW15R-1STE1LF; Mouser Price/Stock: https://www.mouser.com/Search/Refine.aspx?Keyword=649-SFW15R-1STE1LF; RS Part Number: 1822728; RS Price/Stock: https://uk.rs-online.com/web/p/products/1822728
J95-J102 = PHOENIX_1725672: Terminal Block, 4 Positions, Screw Connection; Part Description: 6A, 63V, Terminal Block, Pitch 2.54mm, 4 Positions, Screw Connection; Manufacturer: PHOENIX CONTACT; Manufacturer Part Number: 1725672 (MPT 0,5/4-2,54); PressFit: No; Part Number: PHOENIX_1725672; Component Kind: Standard; Component Type: Standard; Pin Count: 4; Mounted: Yes; Socket: No; SMD: No; Sense: No; Status: None; ComponentHeight: 8.5mm; HelpURL: \\cern.ch\dfs\Applications\Altium\Datasheets\PHOENIX_1725672.pdf; Author: CERN DEM JMW; CreateDate: 07.11.2008; LatestRevisionDate: 26.04.2010
R2 R3 = R0402_0R_JUMPER: as R1 on sheet RTD_Channel; Part Number: R0402_0R_JUMPER; Component Kind: Standard; Component Type: Standard; Pin Count: 2; Value: 0; Status: Not Recommended; Manufacturer Part Number: R0402_0R_JUMPER; Case: 0402; Mounted: Yes; Sense: No; Socket: No; SMD: Yes; Manufacturer1 Example: YAGEO PHYCOMP; Manufacturer1 ComponentHeight: 0.4mm; HelpURL: \\cern.ch\dfs\Applications\Altium\Datasheets\R0402_Phycomp_RC0402.pdf; Author: CERN DEM JLC; CreateDate: 03/12/2007; LatestRevisionDate: 17/10/2012
X13 = SGET_CamConn_FCI_Hirose: Part_Number: 41500541; BOM_Level: 1; Revision: A

## Nets that join several sheets
GND: Temp_recorder_SAMD21 (54 pins), W5500 (23 pins), U_RTD_Channel0 (8 pins), U_RTD_Channel1 (8 pins), U_RTD_Channel2 (8 pins), U_RTD_Channel3 (8 pins), U_RTD_Channel4 (8 pins), U_RTD_Channel5 (8 pins), U_RTD_Channel6 (8 pins), U_RTD_Channel7 (8 pins), Supply (20 pins), Adapters (48 pins)
P3V3: Temp_recorder_SAMD21 (35 pins), W5500 (9 pins), U_RTD_Channel0 (C224A.1 C225A.1 IC84A.19 L13A.2), U_RTD_Channel1 (C224B.1 C225B.1 IC84B.19 L13B.2), U_RTD_Channel2 (C224C.1 C225C.1 IC84C.19 L13C.2), U_RTD_Channel3 (C224D.1 C225D.1 IC84D.19 L13D.2), U_RTD_Channel4 (C224E.1 C225E.1 IC84E.19 L13E.2), U_RTD_Channel5 (C224F.1 C225F.1 IC84F.19 L13F.2), U_RTD_Channel6 (C224G.1 C225G.1 IC84G.19 L13G.2), U_RTD_Channel7 (C224H.1 C225H.1 IC84H.19 L13H.2), Supply (9 pins)
P5V0: Temp_recorder_SAMD21 (D12.4 J28.1), Supply (D13.2)
AT_EVENT: Temp_recorder_SAMD21 (IC13.29), Supply (IC16.4 R95.1)
ETH_INT: Temp_recorder_SAMD21 (IC13.4), W5500 (IC33.36)
ETH_RESETn: Temp_recorder_SAMD21 (IC13.3), W5500 (IC33.37)
FORCE_N0: Temp_recorder_SAMD21 (J1.5), U_RTD_Channel0 (IC84A.9)
FORCE_N1: Temp_recorder_SAMD21 (J1.9), U_RTD_Channel1 (IC84B.9)
FORCE_N2: Temp_recorder_SAMD21 (J1.13), U_RTD_Channel2 (IC84C.9)
FORCE_N3: Temp_recorder_SAMD21 (J1.17), U_RTD_Channel3 (IC84D.9)
FORCE_N4: Temp_recorder_SAMD21 (J1.21), U_RTD_Channel4 (IC84E.9)
FORCE_N5: Temp_recorder_SAMD21 (J1.25), U_RTD_Channel5 (IC84F.9)
FORCE_N6: Temp_recorder_SAMD21 (J1.29), U_RTD_Channel6 (IC84G.9)
FORCE_N7: Temp_recorder_SAMD21 (J1.33), U_RTD_Channel7 (IC84H.9)
FORCE_P0: Temp_recorder_SAMD21 (J1.2), U_RTD_Channel0 (IC84A.5)
FORCE_P1: Temp_recorder_SAMD21 (J1.6), U_RTD_Channel1 (IC84B.5)
FORCE_P2: Temp_recorder_SAMD21 (J1.10), U_RTD_Channel2 (IC84C.5)
FORCE_P3: Temp_recorder_SAMD21 (J1.14), U_RTD_Channel3 (IC84D.5)
FORCE_P4: Temp_recorder_SAMD21 (J1.18), U_RTD_Channel4 (IC84E.5)
FORCE_P5: Temp_recorder_SAMD21 (J1.22), U_RTD_Channel5 (IC84F.5)
FORCE_P6: Temp_recorder_SAMD21 (J1.26), U_RTD_Channel6 (IC84G.5)
FORCE_P7: Temp_recorder_SAMD21 (J1.30), U_RTD_Channel7 (IC84H.5)
MAX_CS0: Temp_recorder_SAMD21 (IC1.15), U_RTD_Channel0 (IC84A.13)
MAX_CS1: Temp_recorder_SAMD21 (IC1.14), U_RTD_Channel1 (IC84B.13)
MAX_CS2: Temp_recorder_SAMD21 (IC1.13), U_RTD_Channel2 (IC84C.13)
MAX_CS3: Temp_recorder_SAMD21 (IC1.12), U_RTD_Channel3 (IC84D.13)
MAX_CS4: Temp_recorder_SAMD21 (IC1.11), U_RTD_Channel4 (IC84E.13)
MAX_CS5: Temp_recorder_SAMD21 (IC1.10), U_RTD_Channel5 (IC84F.13)
MAX_CS6: Temp_recorder_SAMD21 (IC1.9), U_RTD_Channel6 (IC84G.13)
MAX_CS7: Temp_recorder_SAMD21 (IC1.7), U_RTD_Channel7 (IC84H.13)
MAX_MISO: Temp_recorder_SAMD21 (IC13.25), U_RTD_Channel0 (IC84A.14), U_RTD_Channel1 (IC84B.14), U_RTD_Channel2 (IC84C.14), U_RTD_Channel3 (IC84D.14), U_RTD_Channel4 (IC84E.14), U_RTD_Channel5 (IC84F.14), U_RTD_Channel6 (IC84G.14), U_RTD_Channel7 (IC84H.14)
MAX_MOSI: Temp_recorder_SAMD21 (IC13.27), U_RTD_Channel0 (IC84A.11), U_RTD_Channel1 (IC84B.11), U_RTD_Channel2 (IC84C.11), U_RTD_Channel3 (IC84D.11), U_RTD_Channel4 (IC84E.11), U_RTD_Channel5 (IC84F.11), U_RTD_Channel6 (IC84G.11), U_RTD_Channel7 (IC84H.11)
MAX_SCLK: Temp_recorder_SAMD21 (IC13.28), U_RTD_Channel0 (IC84A.12), U_RTD_Channel1 (IC84B.12), U_RTD_Channel2 (IC84C.12), U_RTD_Channel3 (IC84D.12), U_RTD_Channel4 (IC84E.12), U_RTD_Channel5 (IC84F.12), U_RTD_Channel6 (IC84G.12), U_RTD_Channel7 (IC84H.12)
POE_VC+: W5500 (D2.1 D3.1 D4.1 D5.1), Supply (L19.1 R140.2)
POE_VC-: W5500 (D6.2 D7.2 D8.2 D9.2), Supply (R146.1 R166.1 R184.1 T7.2)
RTDIN_N0: Temp_recorder_SAMD21 (J1.4), U_RTD_Channel0 (C156A.2 IC84A.8)
RTDIN_N1: Temp_recorder_SAMD21 (J1.8), U_RTD_Channel1 (C156B.2 IC84B.8)
RTDIN_N2: Temp_recorder_SAMD21 (J1.12), U_RTD_Channel2 (C156C.2 IC84C.8)
RTDIN_N3: Temp_recorder_SAMD21 (J1.16), U_RTD_Channel3 (C156D.2 IC84D.8)
RTDIN_N4: Temp_recorder_SAMD21 (J1.20), U_RTD_Channel4 (C156E.2 IC84E.8)
RTDIN_N5: Temp_recorder_SAMD21 (J1.24), U_RTD_Channel5 (C156F.2 IC84F.8)
RTDIN_N6: Temp_recorder_SAMD21 (J1.28), U_RTD_Channel6 (C156G.2 IC84G.8)
RTDIN_N7: Temp_recorder_SAMD21 (J1.32), U_RTD_Channel7 (C156H.2 IC84H.8)
RTDIN_P0: Temp_recorder_SAMD21 (J1.3), U_RTD_Channel0 (C156A.1 IC84A.7 R351A.2)
RTDIN_P1: Temp_recorder_SAMD21 (J1.7), U_RTD_Channel1 (C156B.1 IC84B.7 R351B.2)
RTDIN_P2: Temp_recorder_SAMD21 (J1.11), U_RTD_Channel2 (C156C.1 IC84C.7 R351C.2)
RTDIN_P3: Temp_recorder_SAMD21 (J1.15), U_RTD_Channel3 (C156D.1 IC84D.7 R351D.2)
RTDIN_P4: Temp_recorder_SAMD21 (J1.19), U_RTD_Channel4 (C156E.1 IC84E.7 R351E.2)
RTDIN_P5: Temp_recorder_SAMD21 (J1.23), U_RTD_Channel5 (C156F.1 IC84F.7 R351F.2)
RTDIN_P6: Temp_recorder_SAMD21 (J1.27), U_RTD_Channel6 (C156G.1 IC84G.7 R351G.2)
RTDIN_P7: Temp_recorder_SAMD21 (J1.31), U_RTD_Channel7 (C156H.1 IC84H.7 R351H.2)
SPI0_MISO: Temp_recorder_SAMD21 (IC13.13 IC14.2), W5500 (IC33.34)
SPI0_MOSI: Temp_recorder_SAMD21 (IC13.15 IC14.5), W5500 (IC33.35)
SPI0_SCK: Temp_recorder_SAMD21 (IC13.16 IC14.6), W5500 (IC33.33)
SPI0_SS0: Temp_recorder_SAMD21 (IC13.14), W5500 (IC33.32)